# Altium schematic sheet USB.SchDoc
size A4; SheetNumber: 6; SheetTotal: 11; SPICEModelCacheVCEAXSSD: <root> / <DocumentId>VCEAXSSD</DocumentId> / </root>
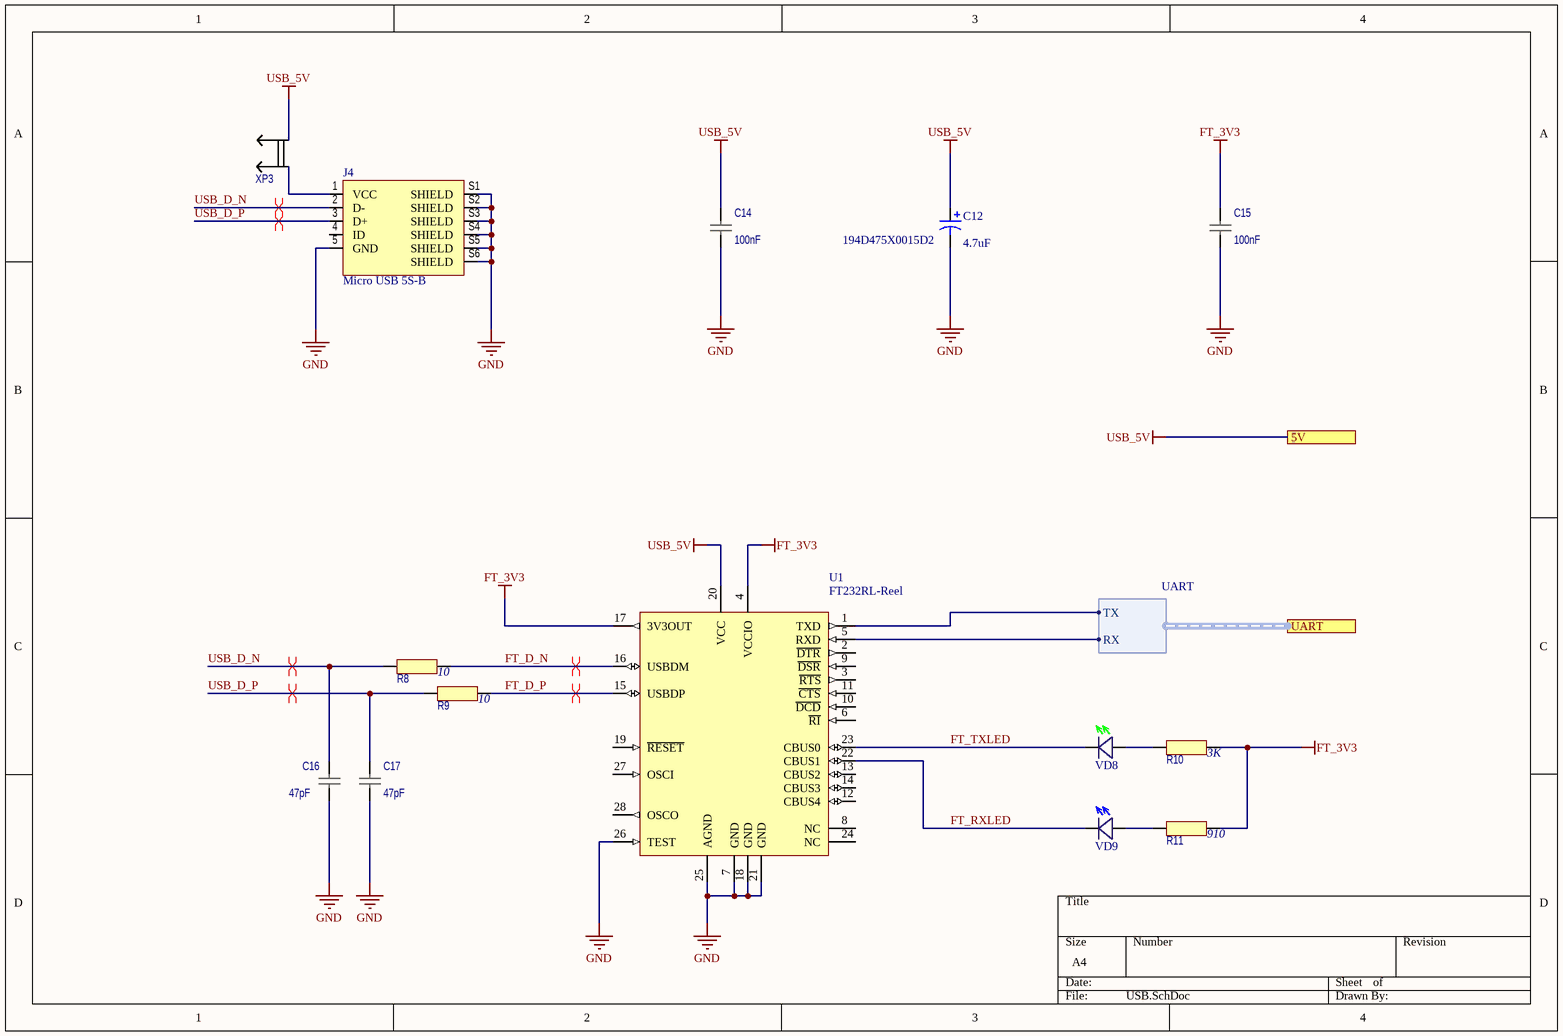
[diagram p0: USB.SchDoc]

## Parts
C12  194D475X0015D2  value 4.7uF  [D]
C14  value 100nF  [C0805]  (hidden comment: C0805)
C15  value 100nF  [C0805]  (hidden comment: C0805)
C16  value 47pF  [C0805]  (hidden comment: C0805)
C17  value 47pF  [C0805]  (hidden comment: C0805)
J4  Micro USB 5S-B  [KLS1-233-0-0-1-T]
R8  value 10  [R0805]  (hidden comment: R0805)
R9  value 10  [R0805]  (hidden comment: R0805)
R10  value 3K  [R0805]  (hidden comment: R0805)
R11  value 910  [R0805]  (hidden comment: R0805)
U1  FT232RL-Reel  [SSOP-28_N]
VD8  TO-1608BC-PG  [TO-1608BC-PG]  (value not drawn)
VD9  TO-1608BC-BF  [TO-1608BC-BF]  (value not drawn)
XP3  Замыкатель MJ-O-8KLS  [PLS-2]  (value not drawn)

## Ports
5V, UART (harness UART)

## Harnesses
UART: TX, RX

## Nets
FT_3V3: C15.2 R10.1 R11.1 U1.4(VCCIO) U1.17(3V3OUT)
GND: C12.2 C14.1 C15.1 C16.1 C17.1 J4.5(GND) J4.S1(SHIELD) J4.S2(SHIELD) J4.S3(SHIELD) J4.S4(SHIELD) J4.S5(SHIELD) J4.S6(SHIELD) U1.7(GND) U1.18(GND) U1.21(GND) U1.25(AGND) U1.26(TEST)
USB_5V: C12.1 C14.2 U1.20(VCC) XP3.2 ; port 5V
FT_D_N: R8.1 U1.16(USBDM)
FT_D_P: R9.1 U1.15(USBDP)
FT_RXLED: U1.22(CBUS1) VD9.-
FT_TXLED: U1.23(CBUS0) VD8.-
USB_D_N: C16.2 J4.2(D-) R8.2
USB_D_P: C17.2 J4.3(D+) R9.2
NetJ4_1: J4.1(VCC) XP3.1
NetR10_2: R10.2 VD8.+
NetR11_2: R11.2 VD9.+
NetU1_1: U1.1(TXD) ; port UART.TX
NetU1_5: U1.5(RXD) ; port UART.RX

Not connected (* = marked no-connect by the designer): J4 4(ID); U1 2(~{DTR}) 3(~{RTS}) 6(~{RI}) 8(NC) 9(~{DSR}) 10(~{DCD}) 11(~{CTS}) 12(CBUS4) 13(CBUS2) 14(CBUS3) 19(~{RESET}) 24(NC) 27(OSCI) 28(OSCO)

## Layout directives
differential pair: FT_D_N, FT_D_P, USB_D_N, USB_D_P

## Library data of the parts
C12 = 194D475X0015D2: Midget Conformal Coated Solid Tantalum Chip Capacitor: 4.7uF, 20% Tolerance, 15 WVDC @ +85°C, Surge = 20V; Note: See Data Sheet for full range of components; Published: 19-Mar-2004; PackageReference: D; Publisher: Altium Limited; DatasheetDocument: 05-Jul-2002; ComponentLink1Description: Manufacturer Link; ComponentLink1URL: http://www.vishay.com/; ComponentLink2Description: Datasheet; ComponentLink2URL: http://www.vishay.com/docs/40000/194d.pdf
C14-C17 = C0805: Tolerance: %; Voltage: B; Case: *; Dielectric: *; Mount: *; PartNumber: *
J4 = KLS1-233-0-0-1-T
U1 = FT232RL-Reel: USB UART Asynchronous Serial Data Transfer Chip, 28-pin SSOP, Tape and Reel; Manufacturer: FTDI; DatasheetVersion: ver 2.10, Mar-2012; PackageVersion: Mar-12; PackageReference: SSOP-28; PackageDescription: 28-Pin Small Outline Package 0.65 mm Pitch; PartNumber: FT232RL-Reel; ComponentLink1Description: Manufacturer URL; ComponentLink1URL: http://www.ftdichip.com/; ComponentLink2Description: Datasheet; ComponentLink2URL: http://www.ftdichip.com/Support/Documents/DataSheets/ICs/DS_FT232R.pdf
VD8 = TO-1608BC-PG: LED SMD 1608 705мКд, 120°, 525нМ (Pure Green)
VD9 = TO-1608BC-BF: LED SMD 1608 247мКд, 120°, 468нМ (Blue)
XP3 = JP2: Company: KLS electronic co ltd; PartNumber: MJ-O-8KLS
R8-R11 = R0805: Case: *; Mount: *; PartNumber: *; Power: *; Tolerance: *